# EAGLE design 1V8_Arc_Welder (EAGLE 7.2.0)
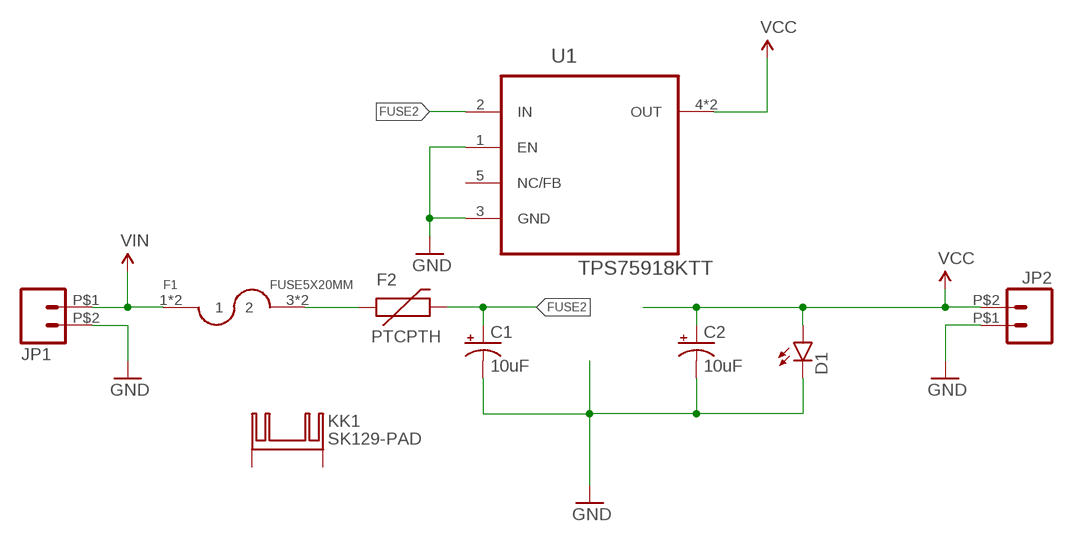
[diagram p0: schematic, sheet 1]

## Parts
C1  10uF  CPOL-USE2-5  [E2-5]
C2  10uF  CPOL-USE2-5  [E2-5]
D1  LED5MM  [LED5MM]
F1  FUSE5X20MM  [FUSE_1A3399]
F2  PTCPTH  [PTC]
JP1  M02TE-282834-2  [1X02_282834-2]
JP2  M02TE-282834-2  [1X02_282834-2]
KK1  SK129-PAD  [SK129]
U1  TPS75918KTT  [TO263-5]

## Nets
FUSE1: F1.3 F1.4 F2.P$1
FUSE2: C1.+ F2.P$2 U1.2(IN)
GND: C1.- C2.- D1.K(C) JP1.P$2 JP2.P$1 U1.1(EN) U1.3(GND)
VCC: C2.+ D1.A JP2.P$2 U1.4(OUT) U1.6(OUT)
VIN: F1.1 F1.2 JP1.P$1
Unconnected: KK1.A2,5(K) KK1.B2,5(K) U1.5(NC/FB)

## Library data of the parts
C1 C2 = rcl:CPOL-US: POLARIZED CAPACITOR, American symbol
D1 = SparkFun-LED:LED: LEDs Standard schematic elements and footprints for 5mm, 3mm, 1206, and 0603 sized LEDs. 5mm - Spark Fun Electronics SKU : COM-00529 (and others)
F1 = DensityAltitude:FUSE5
F2 = DensityAltitude:PTC: Resettable Fuse PTC Resettable Fuse. Spark Fun Electronics SKU : COM-08357
JP1 JP2 = DensityAltitude:M02: Standard 2-pin 0.1" header. Use with - straight break away headers ( PRT-00116) - right angle break away headers (PRT-00553) - swiss pins (PRT-00743) - machine pins (PRT-00117) - female headers (PRT-00115) Molex polarized connector foot print use with: PRT-08233 with associated crimp pins and housings. 2.54_SCREWTERM for use with PRT-10571. 3.5mm Screw Terminal footprints for PRT-08084 5mm Screw Terminal footprints for use with PRT-08432
KK1 = heatsink:SK129-PAD: HEATSINK manufacturer Fischer/distributor Buerklin
U1 = DensityAltitude:TPS75918: Low power 150-mA low-dropout linear regulators

## Board
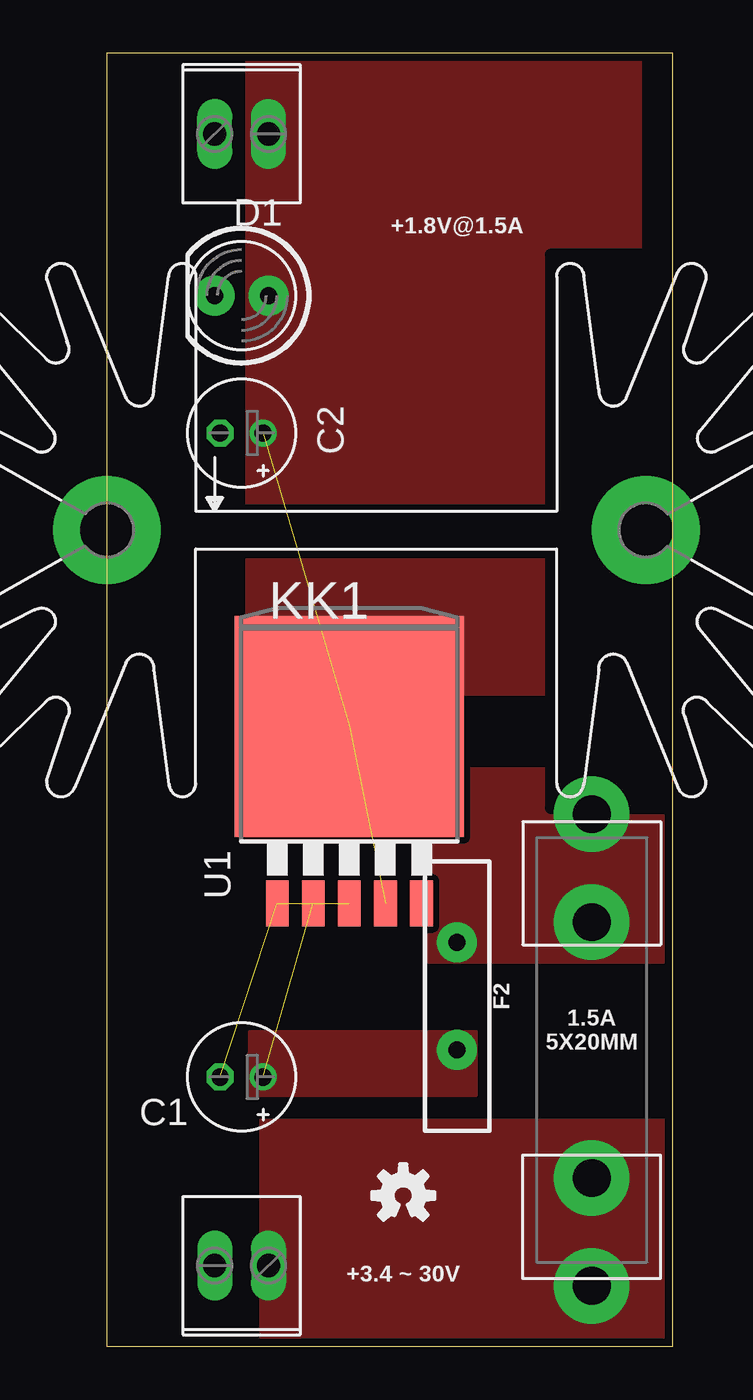
[diagram p1: board, top side]
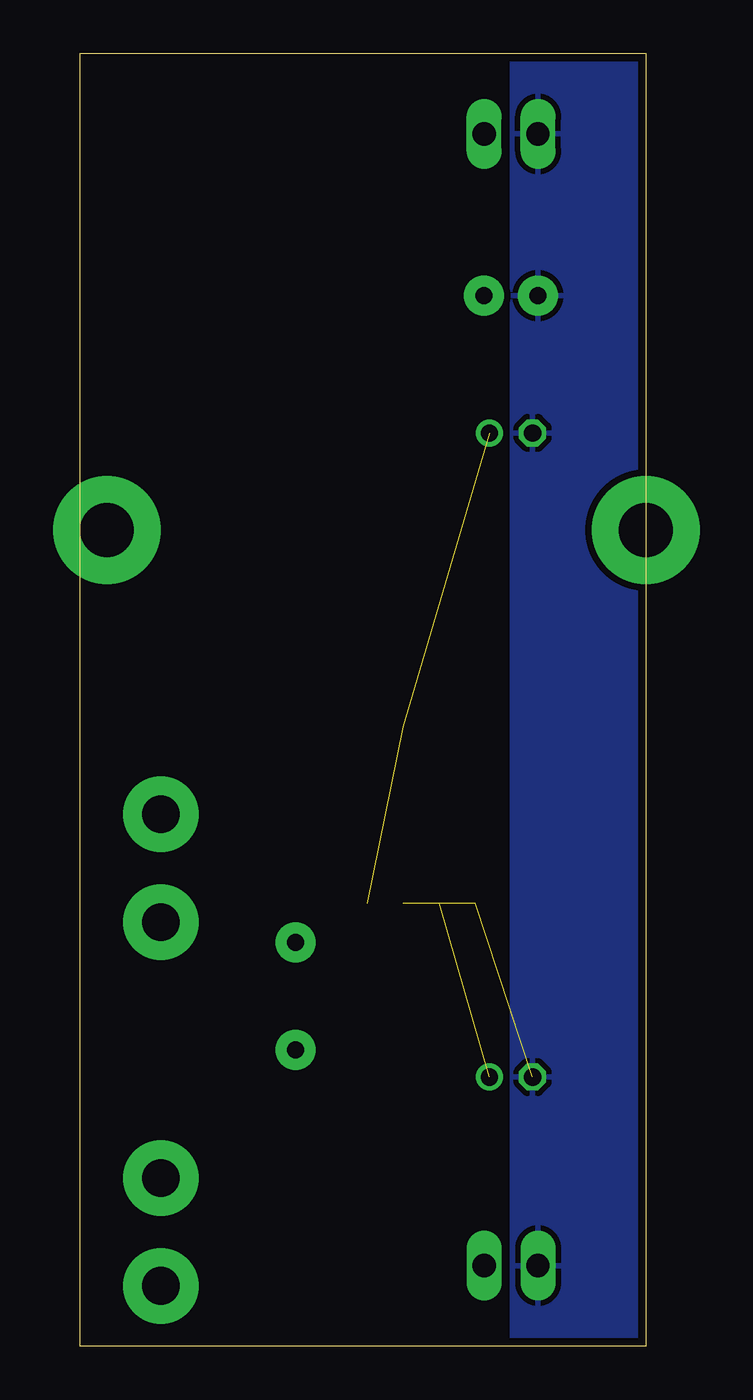
[diagram p2: board, bottom side, seen from below]

Size 26.67 x 60.96 mm. Coordinates in mm from the lower left corner, seen from the top.
Outline: 0,0 26.67,0 26.67,60.96 0,60.96 0,0
Copper layers (1*16): Top 0.0356mm / dielectric 1.5011mm / Bottom 0.0356mm
Design rules "oshpark-2layer": minimum track width 6mil, minimum drill 13mil, track to track 6mil, track to pad 6mil, pad to pad 6mil, via to via 6mil, smd to smd 6mil, copper to edge 15mil, drill to drill 6mil, minimum pad ring 7mil, minimum via ring 7mil, stop-mask expansion 4mil, vias tented up to drill 0mil, thermal gap 10mil

### Footprints (pad centres in the part's own frame; a part is rotated, then mirrored left to right if it is on the bottom)
E2-5 = drill 0.813 pad 1.27: + -1.016,0 | drill 0.813 pad 1.27 octagon: - 1.016,0
LED5MM = drill 0.813 pad 1.88: A -1.27,0; K 1.27,0
FUSE_1A3399 = drill 1.778 pad 3.556: 1 0,-11.113; 2 0,-6.032; 3 0,6.032; 4 0,11.113
PTC = drill 0.8 pad 1.88: P$1 -2.54,0; P$2 2.54,0
1X02_282834-2 = drill 1.1 long: P$1 -1.27,0; P$2 1.27,0
SK129 = drill 2.54 pad 5.08: A2,5 -12.7,-0.889; B2,5 12.7,-0.889
TO263-5 = smd 1.067 x 2.159: 1 -3.404,-5.791; 2 -1.702,-5.791; 3 0,-5.791; 4 1.702,-5.791; 5 3.404,-5.791 | smd 10.8 x 10.41: 6 0,2.54

### Placement (x,y rotation side)
C1  6.35,12.7 180 top
C2  6.35,43.05 180 top
D1  6.35,49.53 180 top
F1  22.86,13.97 0 top
F2  16.51,16.51 270 top
JP1  6.35,3.81 180 top
JP2  6.35,57.15 0 top
KK1  12.7,39.37 0 top
U1  11.43,26.67 0 top
U$1  [OSHW-LOGO-S]  13.97,7.11 0 top

### Tracks (layer width: path | path; a pad name or v marks a point on that pad's centre or on a via)
FUSE1
  pour Top (isolate 0.305, no thermals): 14.99,27.18 26.29,27.18 26.29,18.16 14.99,18.16
FUSE2  (1 unrouted)
  pour Top (isolate 0.305, no thermals): 6.73,14.86 17.4,14.86 17.4,11.81 6.73,11.81
GND  (2 unrouted)
  pour Bottom (isolate 0.305): 0,60.96 6.35,60.96 6.35,0 0,0
VCC  (2 unrouted)
  pour Top (isolate 0.305, no thermals): 25.15,60.71 25.15,30.73 6.6,30.73 6.6,60.71
VIN
  pour Top (isolate 0.305, no thermals): 7.24,10.67 7.24,0 26.67,0 26.67,10.67

### Text on the board
tPlace: +1.8V@1.5A | 1.5A / 5X20MM | +3.4 ~ 30V